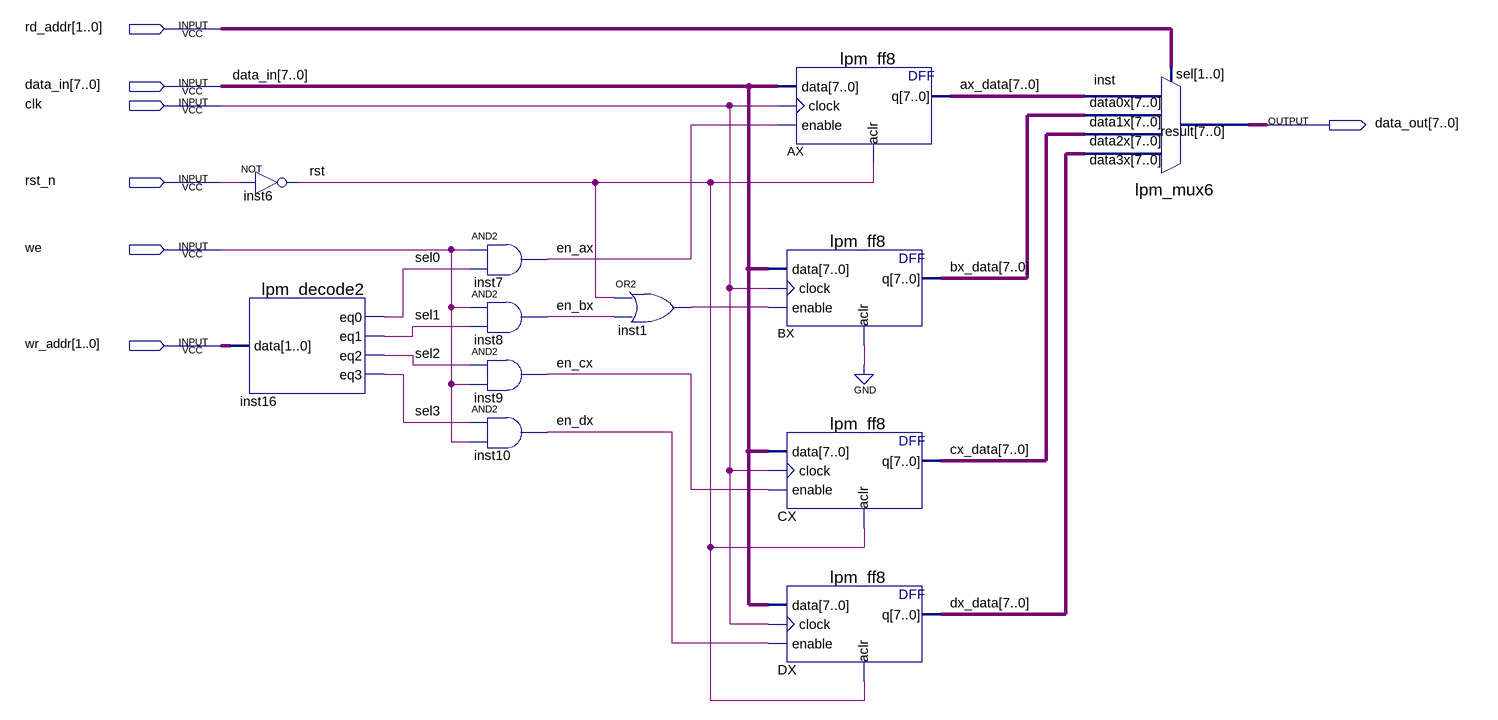
[diagram p0: schematic sheet]
// Quartus schematic ron_unit.bdf as structural Verilog: 12 symbols, 7 pins
module ron_unit (
  input  [1:0] rd_addr,
  input  [7:0] data_in,
  input  clk,
  input  rst_n,
  input  we,
  input  [1:0] wr_addr,
  output [7:0] data_out
);

  wire en_ax, en_bx, en_cx, en_dx, inst1_out, rst, sel0, sel1, sel2, sel3;
  wire [7:0] ax_data, bx_data, cx_data, dx_data;

  not inst6 (rst, rst_n);
  lpm_decode2 inst16 (.data(wr_addr), .eq0(sel0), .eq1(sel1), .eq2(sel2), .eq3(sel3));
  and inst7 (en_ax, we, sel0);
  and inst8 (en_bx, we, sel1);
  and inst9 (en_cx, sel2, we);
  and inst10 (en_dx, sel3, we);
  or inst1 (inst1_out, rst, en_bx);
  lpm_ff8 AX (.data(data_in), .clock(clk), .enable(en_ax), .aclr(rst), .q(ax_data));
  lpm_ff8 BX (.data(data_in), .clock(clk), .enable(inst1_out), .aclr(1'b0), .q(bx_data));
  lpm_ff8 CX (.data(data_in), .clock(clk), .enable(en_cx), .aclr(rst), .q(cx_data));
  lpm_ff8 DX (.data(data_in), .clock(clk), .enable(en_dx), .aclr(rst), .q(dx_data));
  lpm_mux6 inst (
    .data3x(dx_data), .data2x(cx_data), .data1x(bx_data), .data0x(ax_data), .sel(rd_addr), .result(data_out));
endmodule
